# Altium project Cavendish.PrjPcb
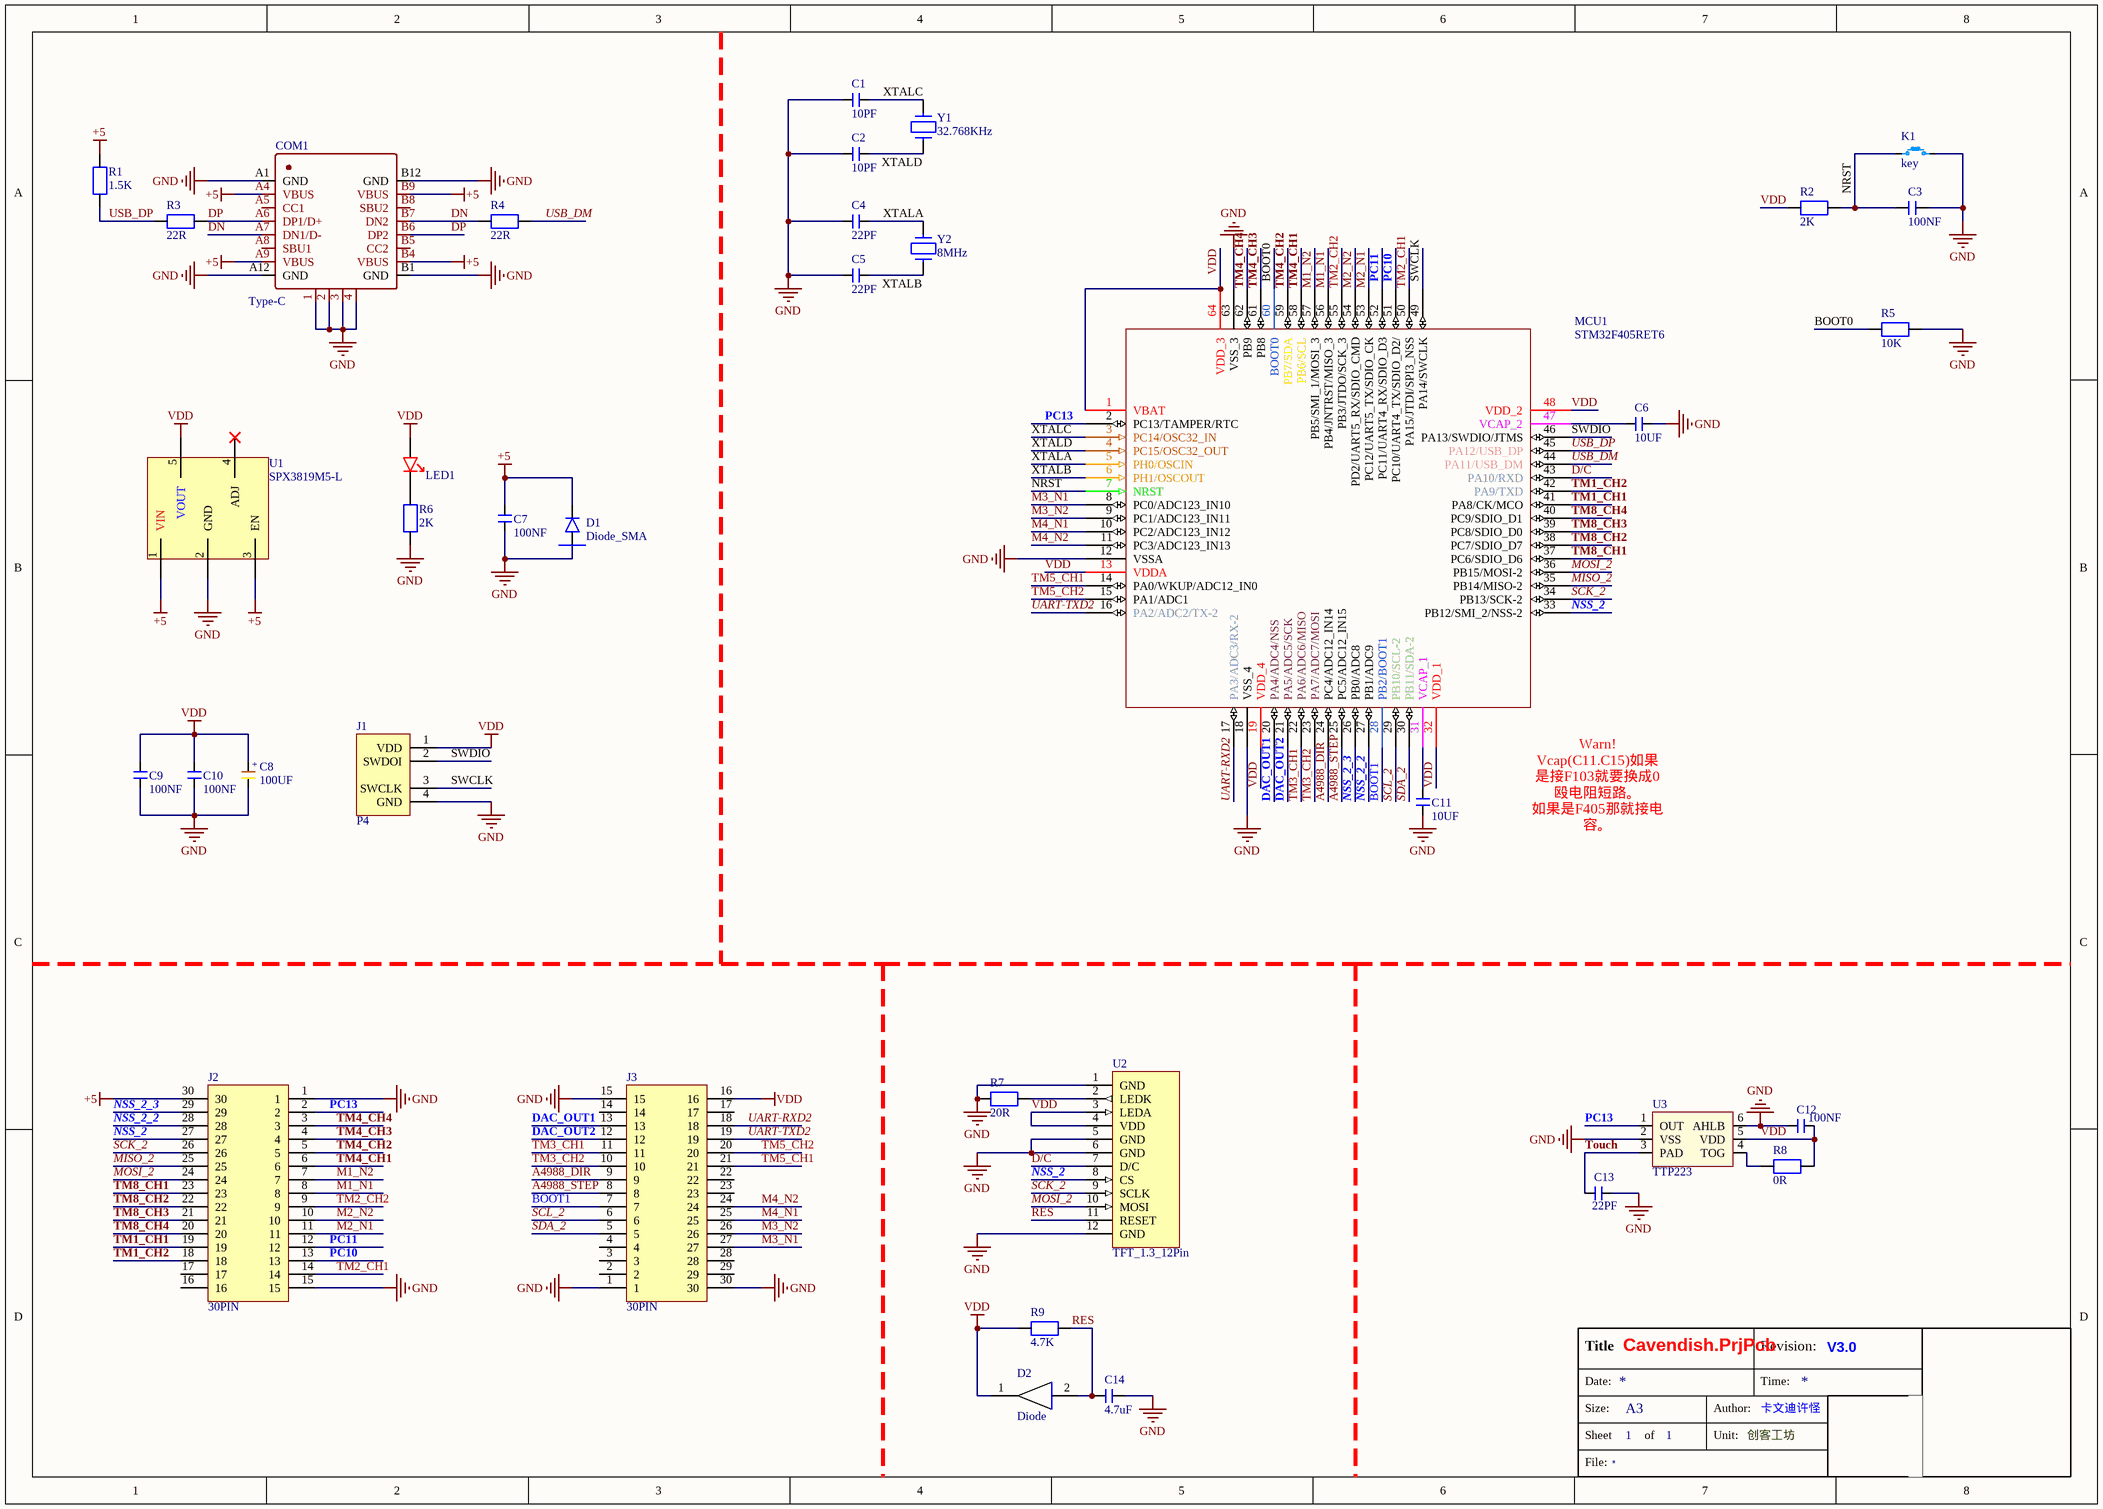
[diagram p0: MCU.SchDoc]
1 sheet, 37 parts. Net scope: global (net labels, ports and power ports of the same name join across sheets).
Board file: Cavend.PcbDoc

## Sheet MCU.SchDoc
size A3; Author: 卡文迪许怪; CompanyName: 创客工坊; Revision: V3.0; SheetNumber: 1; SheetTotal: 1

### Parts
C1  10PF  [CAP_0603]
C2  10PF  [CAP_0603]
C3  100NF  [CAP_0603]
C4  22PF  [CAP_0603]
C5  22PF  [CAP_0603]
C6  10UF  [CAP_0603]
C7  100NF  [CAP_0603]
C8  100UF  [CAP_3528_B]
C9  100NF  [CAP_0603]
C10  100NF  [CAP_0603]
C11  10UF  [CAP_0603]
C12  100NF  [CAP_0603]
C13  22PF  [CAP_0603]
C14  4.7uF  [CAP_0603]
COM1  Type-C  [USB-tYPE_C_C]
D1  Diode_SMA  [DIODE_SOD123]
D2  Diode  [SOD123]
J1  P4  [XH2.54-WS-4P]
J2  30PIN  [BTB_Double_30Pin_Up]
J3  30PIN  [BTB_Double_30Pin_Up]
K1  key  [KEY-A]
LED1  LED_R/G/B/Y  [LED_0603_R]  (value not drawn)
MCU1  STM32F405RET6  [LQFP_64_10X10]
R1  1.5K  [RESC_0603_2]
R2  2K  [RESC_0603_2]
R3  22R  [RESC_0603_2]
R4  22R  [RESC_0603_2]
R5  10K  [RESC_0603_2]
R6  2K  [RESC_0603_2]
R7  20R  [RESC_0603_2]
R8  0R  [RESC_0603_2]
R9  4.7K  [RESC_0603_2]
U1  SPX3819M5-L  [SOT23_5]
U2  TFT_1.3_12Pin  [LCD_1.3B]
U3  TTP223  [SOT-23-6]
Y1  32.768KHz  [XTAL_SMD_3215]
Y2  8MHz  [XTAL_3225]

### Nets
+5: C7.2 COM1.A4(VBUS) COM1.A9(VBUS) COM1.B4(VBUS) COM1.B9(VBUS) D1.2(N) J2.30 R1.1 U1.1(VIN) U1.3(EN)
GND: C1.2 C2.2 C3.1 C4.2 C5.2 C6.1 C7.1 C8.2 C9.1 C10.1 C11.1 C12.1 C13.2 C14.1 COM1.1 COM1.2 COM1.3 COM1.4 COM1.A1(GND) COM1.A12(GND) COM1.B1(GND) COM1.B12(GND) D1.1(P) J1.4(GND) J2.1 J2.15 J3.1 J3.15 J3.30 K1.1 MCU1.12(VSSA) MCU1.18(VSS_4) MCU1.63(VSS_3) R5.2 R6.2 R7.1 U1.2(GND) U2.1(GND) U2.5(GND) U2.6(GND) U2.12(GND) U3.2(VSS) U3.6(AHLB)
VDD: C8.1 C9.2 C10.2 C12.2 D2.1(N) J1.1(VDD) J3.16 LED1.2(+) MCU1.1(VBAT) MCU1.13(VDDA) MCU1.19(VDD_4) MCU1.32(VDD_1) MCU1.48(VDD_2) MCU1.64(VDD_3) R2.1 R8.2 R9.1 U1.5(VOUT) U2.3(LEDA) U2.4(VDD) U3.5(VDD)
A4988_DIR: J3.9 MCU1.24(PC4/ADC12_IN14)
A4988_STEP: J3.8 MCU1.25(PC5/ADC12_IN15)
BOOT0: MCU1.60(BOOT0) R5.1
BOOT1: J3.7 MCU1.28(PB2/BOOT1)
D/C: MCU1.43(PA10/RXD) U2.7(D/C)
DAC_OUT1: J3.13 MCU1.20(PA4/ADC4/NSS)
DAC_OUT2: J3.12 MCU1.21(PA5/ADC5/SCK)
DN: COM1.A7(DN1/D-) COM1.B7(DN2) R4.1
DP: COM1.A6(DP1/D+) COM1.B6(DP2) R3.1
M1_N1: J2.8 MCU1.56(PB4/JNTRST/MISO_3)
M1_N2: J2.7 MCU1.57(PB5/SMI_1/MOSI_3)
M2_N1: J2.11 MCU1.53(PC12/UART5_TX/SDIO_CK)
M2_N2: J2.10 MCU1.54(PD2/UART5_RX/SDIO_CMD)
M3_N1: J3.27 MCU1.8(PC0/ADC123_IN10)
M3_N2: J3.26 MCU1.9(PC1/ADC123_IN11)
M4_N1: J3.25 MCU1.10(PC2/ADC123_IN12)
M4_N2: J3.24 MCU1.11(PC3/ADC123_IN13)
MISO_2: J2.25 MCU1.35(PB14/MISO-2)
MOSI_2: J2.24 MCU1.36(PB15/MOSI-2) U2.10(MOSI)
NRST: C3.2 K1.2 MCU1.7(NRST) R2.2
NSS_2: J2.27 MCU1.33(PB12/SMI_2/NSS-2) U2.8(CS)
NSS_2_2: J2.28 MCU1.27(PB1/ADC9)
NSS_2_3: J2.29 MCU1.26(PB0/ADC8)
PC10: J2.13 MCU1.51(PC10/UART4_TX/SDIO_D2/)
PC11: J2.12 MCU1.52(PC11/UART4_RX/SDIO_D3)
PC13: J2.2 MCU1.2(PC13/TAMPER/RTC) U3.1(OUT)
RES: C14.2 D2.2(P) R9.2 U2.11(RESET)
SCK_2: J2.26 MCU1.34(PB13/SCK-2) U2.9(SCLK)
SCL_2: J3.6 MCU1.29(PB10/SCL-2)
SDA_2: J3.5 MCU1.30(PB11/SDA-2)
SWCLK: J1.3(SWCLK) MCU1.49(PA14/SWCLK)
SWDIO: J1.2(SWDOI) MCU1.46(PA13/SWDIO/JTMS)
TM1_CH1: J2.19 MCU1.41(PA8/CK/MCO)
TM1_CH2: J2.18 MCU1.42(PA9/TXD)
TM2_CH1: J2.14 MCU1.50(PA15/JTDI/SPI3_NSS)
TM2_CH2: J2.9 MCU1.55(PB3/JTDO/SCK_3)
TM3_CH1: J3.11 MCU1.22(PA6/ADC6/MISO)
TM3_CH2: J3.10 MCU1.23(PA7/ADC7/MOSI)
TM4_CH1: J2.6 MCU1.58(PB6/SCL)
TM4_CH2: J2.5 MCU1.59(PB7/SDA)
TM4_CH3: J2.4 MCU1.61(PB8)
TM4_CH4: J2.3 MCU1.62(PB9)
TM5_CH1: J3.21 MCU1.14(PA0/WKUP/ADC12_IN0)
TM5_CH2: J3.20 MCU1.15(PA1/ADC1)
TM8_CH1: J2.23 MCU1.37(PC6/SDIO_D6)
TM8_CH2: J2.22 MCU1.38(PC7/SDIO_D7)
TM8_CH3: J2.21 MCU1.39(PC8/SDIO_D0)
TM8_CH4: J2.20 MCU1.40(PC9/SDIO_D1)
Touch: C13.1 U3.3(PAD)
UART-RXD2: J3.18 MCU1.17(PA3/ADC3/RX-2)
UART-TXD2: J3.19 MCU1.16(PA2/ADC2/TX-2)
USB_DM: MCU1.44(PA11/USB_DM) R4.2
USB_DP: MCU1.45(PA12/USB_DP) R1.2 R3.2
XTALA: C4.1 MCU1.5(PH0/OSCIN) Y2.2
XTALB: C5.1 MCU1.6(PH1/OSCOUT) Y2.1
XTALC: C1.1 MCU1.3(PC14/OSC32_IN) Y1.2
XTALD: C2.1 MCU1.4(PC15/OSC32_OUT) Y1.1
NetC6_2: C6.2 MCU1.47(VCAP_2)
NetC11_2: C11.2 MCU1.31(VCAP_1)
NetLED1_1: LED1.1(-) R6.1
NetR7_2: R7.2 U2.2(LEDK)
NetR8_1: R8.1 U3.4(TOG)

Not connected (* = marked no-connect by the designer): COM1 A5(CC1) A8(SBU1) B5(CC2) B8(SBU2); J2 16 17; J3 2 3 4 14 17 22 23 28 29; U1 4(ADJ)*

### Notes on the sheet
- (near MCU1) Warn!
  Vcap(C11.C15)如果是接F103就要换成0殴电阻短路。
  如果是F405那就接电容。
- Title
- Date:
- Revision:
- Time:
- Size:
- Sheet
- A3
- of
- Author:
- Unit:
- File:
- (in symbol CAP_TA) +

### Library data of the parts
C1 C2 C4-C7 C9-C13 = CAP: CAP  12~50V
C3 C14 = CAP_SDM: CAP
C8 = CAP_TA: CAP  6~12V  钽电容
COM1 = USB-type_c: USB
D1 = Diode-SM: Diode_肖特基
D2 = Diode-SOD: 开关二极管
J1 = SWD
J2 J3 = BTB_DOUBLE_30PIN
LED1 = LED
MCU1 = STM32f4_R: MCU
R1-R9 = RES_S: RES 贴片
U1 = SPX3819M5-L: DC-DC   3.3V  500ma
U2 = LCD_1.3   T: ST7789V-SPI
U3 = TTP223: 触摸芯片
Y1 Y2 = XTAL: CRYSTAL